# EAGLE board registers2-4a (EAGLE 7.5.0), part 1 of 3
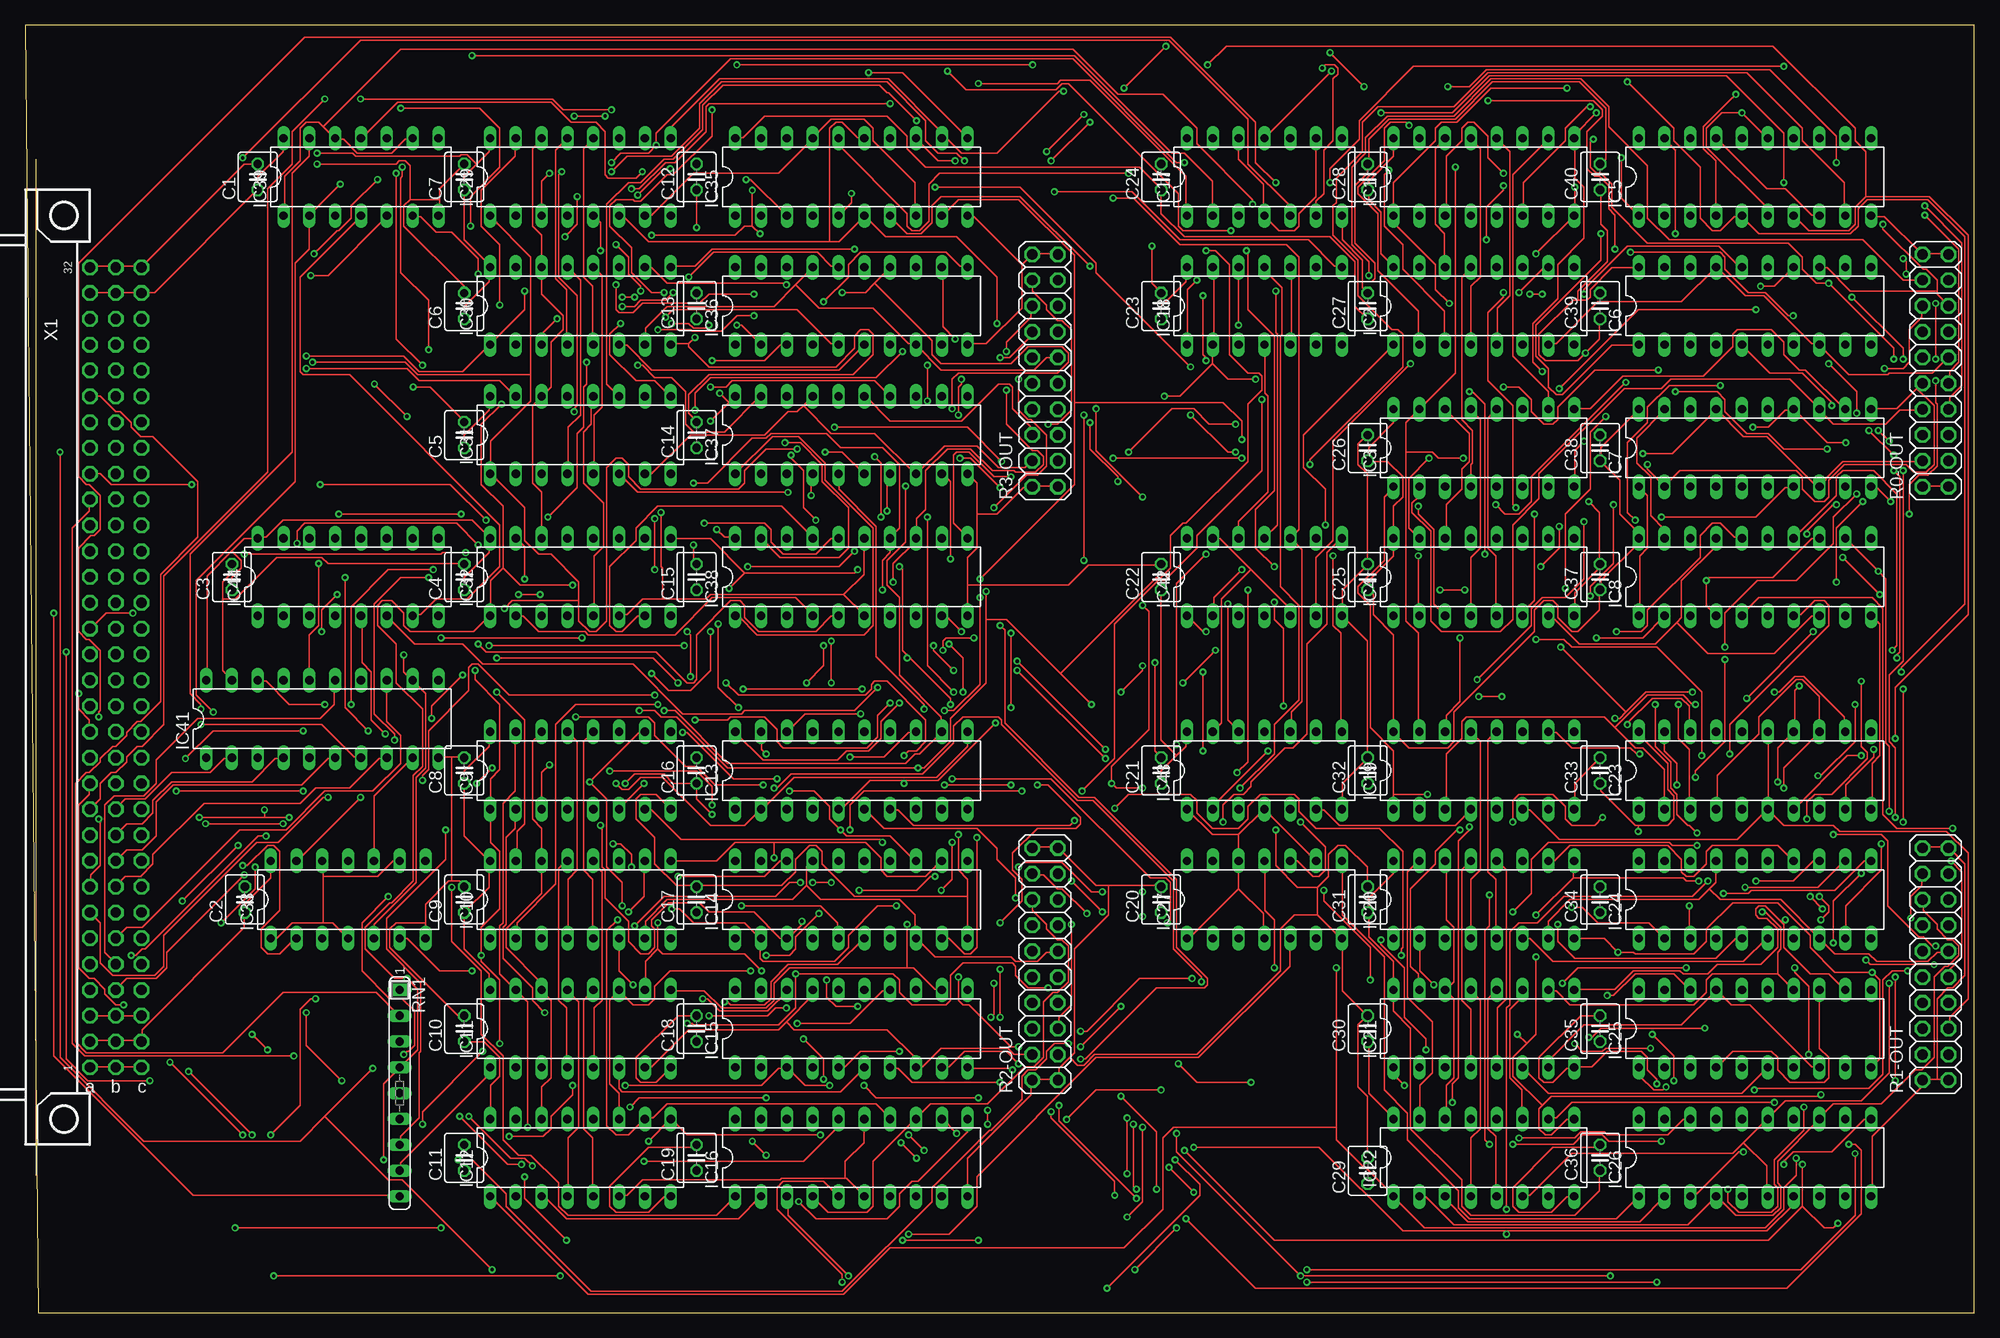
[diagram p3: board, top side]
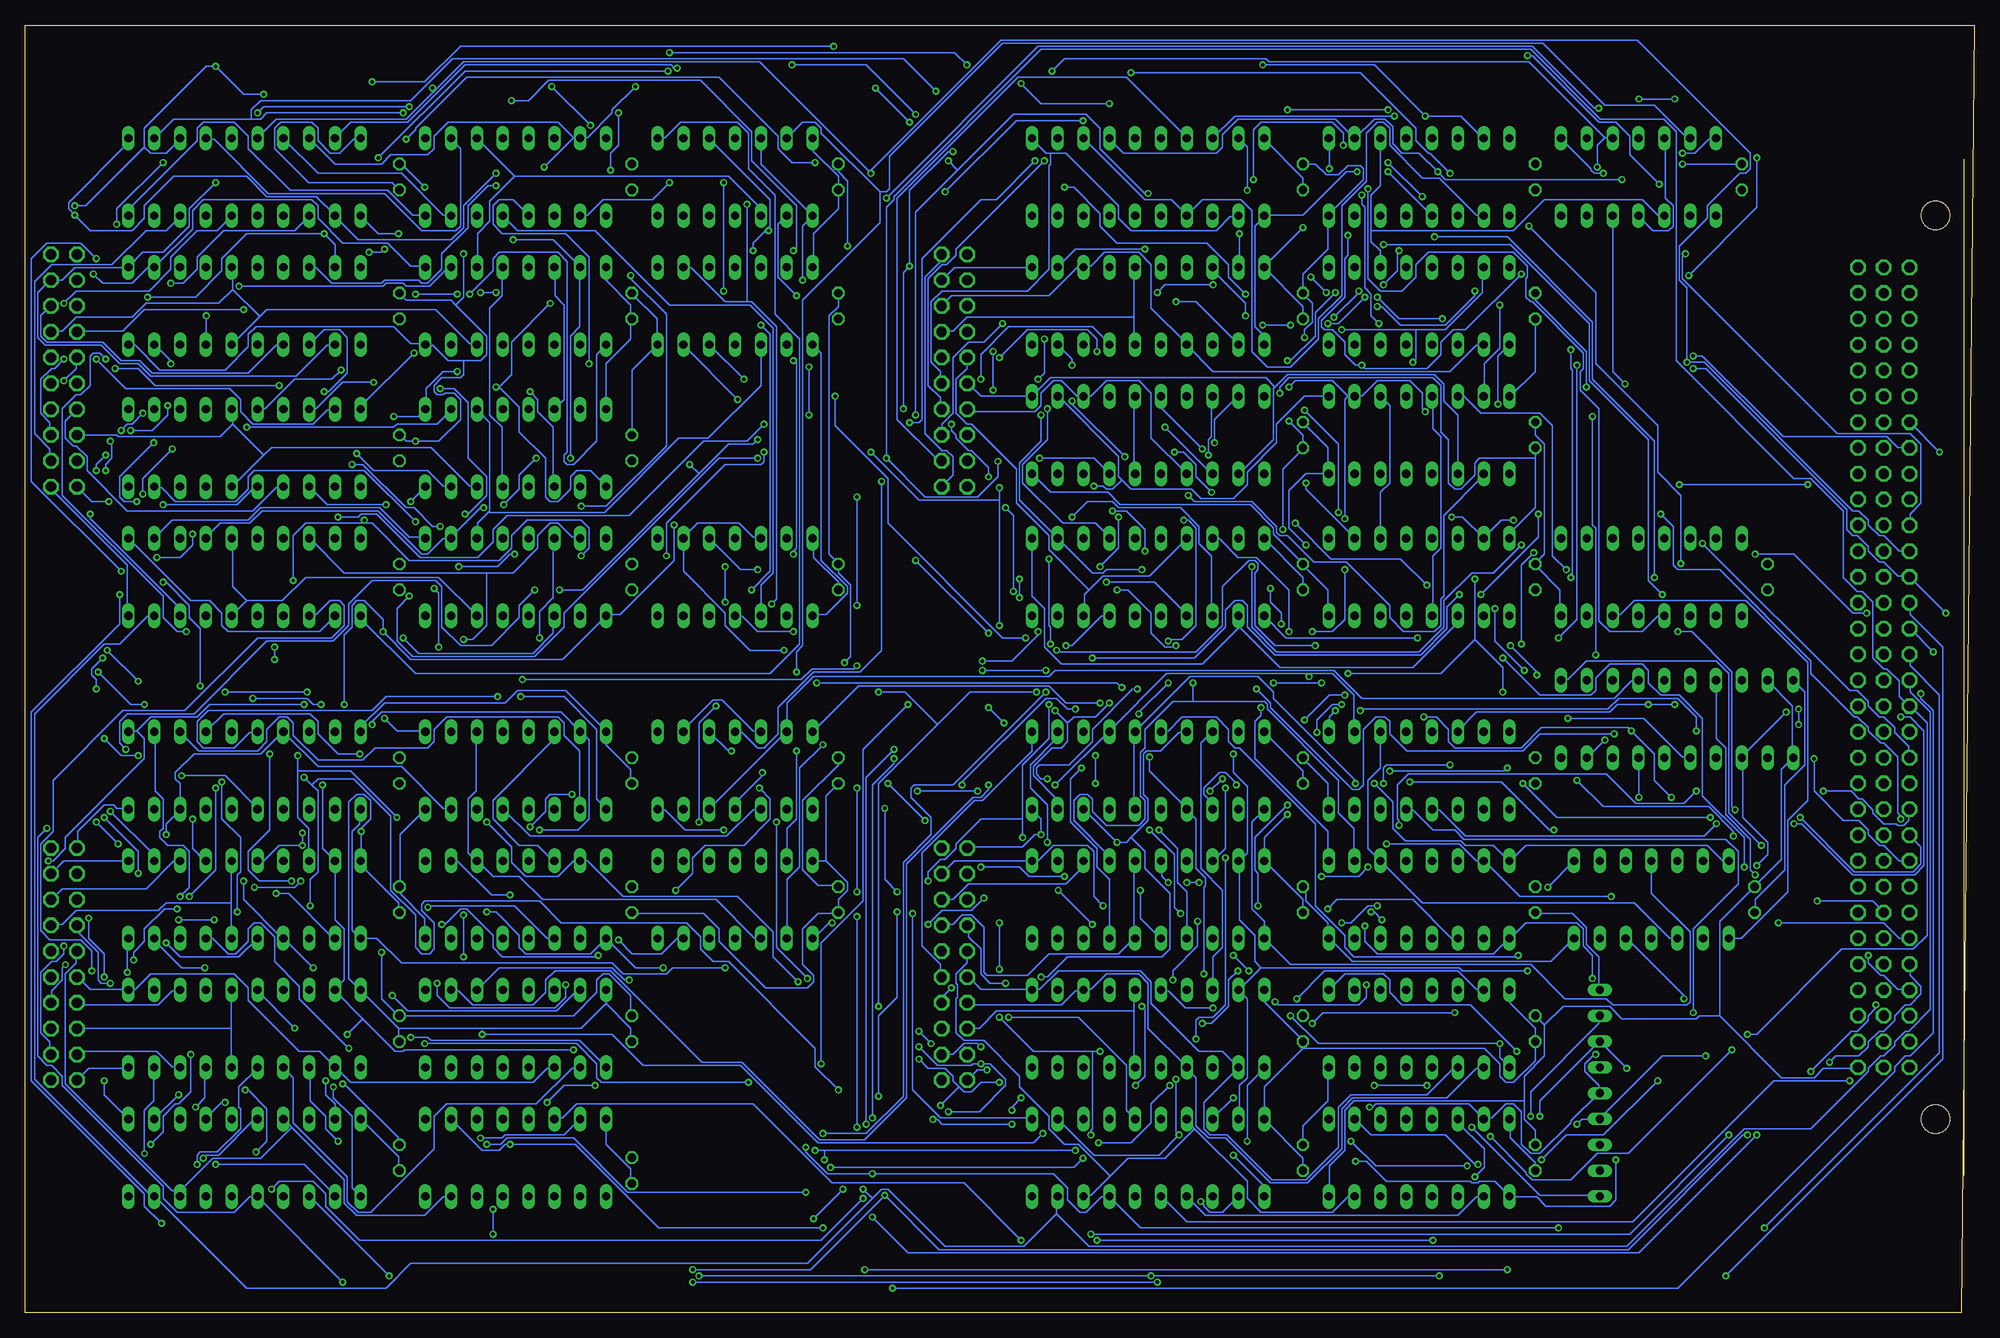
[diagram p4: board, bottom side, seen from below]

Size 191.75 x 126.67 mm. Coordinates in mm from the lower left corner, seen from the top.
Outline: 1.27,0 191.75,0 191.75,126.67 0,126.67 1.27,0
Copper layers (1*16): Top 0.0356mm / dielectric 1.5011mm / Bottom 0.0356mm
Design rules "LaenPCBOrder *": minimum track width 6mil, minimum drill 13mil, track to track 6mil, track to pad 6mil, pad to pad 6mil, via to via 6mil, smd to smd 6mil, copper to edge 15mil, drill to drill 6mil, minimum pad ring 7mil, minimum via ring 7mil, stop-mask expansion 3mil, vias tented up to drill 0mil, thermal gap 10mil

## Footprints (pad centres in the part's own frame; a part is rotated, then mirrored left to right if it is on the bottom)
C025-040X050 = drill 0.813 octagon: 1 -1.27,0; 2 1.27,0
DIL16 = drill 0.813 long: 1 -8.89,-3.81; 2 -6.35,-3.81; 3 -3.81,-3.81; 4 -1.27,-3.81; 5 1.27,-3.81; 6 3.81,-3.81; 7 6.35,-3.81; 8 8.89,-3.81; 9 8.89,3.81; 10 6.35,3.81; 11 3.81,3.81; 12 1.27,3.81; 13 -1.27,3.81; 14 -3.81,3.81; 15 -6.35,3.81; 16 -8.89,3.81
DIL20 = drill 0.813 long: 1 -11.43,-3.81; 2 -8.89,-3.81; 3 -6.35,-3.81; 4 -3.81,-3.81; 5 -1.27,-3.81; 6 1.27,-3.81; 7 3.81,-3.81; 8 6.35,-3.81; 9 8.89,-3.81; 10 11.43,-3.81; 11 11.43,3.81; 12 8.89,3.81; 13 6.35,3.81; 14 3.81,3.81; 15 1.27,3.81; 16 -1.27,3.81; 17 -3.81,3.81; 18 -6.35,3.81; 19 -8.89,3.81; 20 -11.43,3.81
DIL14 = drill 0.813 long: 1 -7.62,-3.81; 2 -5.08,-3.81; 3 -2.54,-3.81; 4 0,-3.81; 5 2.54,-3.81; 6 5.08,-3.81; 7 7.62,-3.81; 8 7.62,3.81; 9 5.08,3.81; 10 2.54,3.81; 11 0,3.81; 12 -2.54,3.81; 13 -5.08,3.81; 14 -7.62,3.81
2X10 = drill 1.016 octagon: 1 -11.43,-1.27; 2 -11.43,1.27; 3 -8.89,-1.27; 4 -8.89,1.27; 5 -6.35,-1.27; 6 -6.35,1.27; 7 -3.81,-1.27; 8 -3.81,1.27; 9 -1.27,-1.27; 10 -1.27,1.27; 11 1.27,-1.27; 12 1.27,1.27; 13 3.81,-1.27; 14 3.81,1.27; 15 6.35,-1.27; 16 6.35,1.27; 17 8.89,-1.27; 18 8.89,1.27; 19 11.43,-1.27; 20 11.43,1.27
SIL9 = drill 0.813 long: 1 -10.16,0; 2 -7.62,0; 3 -5.08,0; 4 -2.54,0; 5 0,0; 6 2.54,0; 7 5.08,0; 8 7.62,0; 9 10.16,0
FABC96R = drill 1.016 octagon: A1 -2.54,39.37; A2 -2.54,36.83; A3 -2.54,34.29; A4 -2.54,31.75; A5 -2.54,29.21; A6 -2.54,26.67; A7 -2.54,24.13; A8 -2.54,21.59; A9 -2.54,19.05; A10 -2.54,16.51; A11 -2.54,13.97; A12 -2.54,11.43; A13 -2.54,8.89; A14 -2.54,6.35; A15 -2.54,3.81; A16 -2.54,1.27; A17 -2.54,-1.27; A18 -2.54,-3.81; A19 -2.54,-6.35; A20 -2.54,-8.89; A21 -2.54,-11.43; A22 -2.54,-13.97; A23 -2.54,-16.51; A24 -2.54,-19.05; A25 -2.54,-21.59; A26 -2.54,-24.13; A27 -2.54,-26.67; A28 -2.54,-29.21; A29 -2.54,-31.75; A30 -2.54,-34.29; A31 -2.54,-36.83; A32 -2.54,-39.37; B1 -5.08,39.37; B2 -5.08,36.83; B3 -5.08,34.29; B4 -5.08,31.75; B5 -5.08,29.21; B6 -5.08,26.67; B7 -5.08,24.13; B8 -5.08,21.59; B9 -5.08,19.05; B10 -5.08,16.51; B11 -5.08,13.97; B12 -5.08,11.43; B13 -5.08,8.89; B14 -5.08,6.35; B15 -5.08,3.81; B16 -5.08,1.27; B17 -5.08,-1.27; B18 -5.08,-3.81; B19 -5.08,-6.35; B20 -5.08,-8.89; B21 -5.08,-11.43; B22 -5.08,-13.97; B23 -5.08,-16.51; B24 -5.08,-19.05; B25 -5.08,-21.59; B26 -5.08,-24.13; B27 -5.08,-26.67; B28 -5.08,-29.21; B29 -5.08,-31.75; B30 -5.08,-34.29; B31 -5.08,-36.83; B32 -5.08,-39.37; C1 -7.62,39.37; C2 -7.62,36.83; C3 -7.62,34.29; C4 -7.62,31.75; C5 -7.62,29.21; C6 -7.62,26.67; C7 -7.62,24.13; C8 -7.62,21.59; C9 -7.62,19.05; C10 -7.62,16.51; C11 -7.62,13.97; C12 -7.62,11.43; C13 -7.62,8.89; C14 -7.62,6.35; C15 -7.62,3.81; C16 -7.62,1.27; C17 -7.62,-1.27; C18 -7.62,-3.81; C19 -7.62,-6.35; C20 -7.62,-8.89; C21 -7.62,-11.43; C22 -7.62,-13.97; C23 -7.62,-16.51; C24 -7.62,-19.05; C25 -7.62,-21.59; C26 -7.62,-24.13; C27 -7.62,-26.67; C28 -7.62,-29.21; C29 -7.62,-31.75; C30 -7.62,-34.29; C31 -7.62,-36.83; C32 -7.62,-39.37 | hole 2.794: 0,-44.456; 0,44.456

## Placement (x,y rotation side)
C1  [C025-040X050]  22.86,111.76 90 top
C2  [C025-040X050]  21.59,40.64 90 top
C3  [C025-040X050]  20.32,72.39 90 top
C4  [C025-040X050]  43.18,72.39 90 top
C5  [C025-040X050]  43.18,86.36 90 top
C6  [C025-040X050]  43.18,99.06 90 top
C7  [C025-040X050]  43.18,111.76 90 top
C8  [C025-040X050]  43.18,53.34 90 top
C9  [C025-040X050]  43.18,40.64 90 top
C10  [C025-040X050]  43.18,27.94 90 top
C11  [C025-040X050]  43.18,15.24 90 top
C12  [C025-040X050]  66.04,111.76 90 top
C13  [C025-040X050]  66.04,99.06 90 top
C14  [C025-040X050]  66.04,86.36 90 top
C15  [C025-040X050]  66.04,72.39 90 top
C16  [C025-040X050]  66.04,53.34 90 top
C17  [C025-040X050]  66.04,40.64 90 top
C18  [C025-040X050]  66.04,27.94 90 top
C19  [C025-040X050]  66.04,15.24 90 top
C20  [C025-040X050]  111.76,40.64 90 top
C21  [C025-040X050]  111.76,53.34 90 top
C22  [C025-040X050]  111.76,72.39 90 top
C23  [C025-040X050]  111.76,99.06 90 top
C24  [C025-040X050]  111.76,111.76 90 top
C25  [C025-040X050]  132.08,72.39 90 top
C26  [C025-040X050]  132.08,85.09 90 top
C27  [C025-040X050]  132.08,99.06 90 top
C28  [C025-040X050]  132.08,111.76 90 top
C29  [C025-040X050]  132.08,13.97 90 top
C30  [C025-040X050]  132.08,27.94 90 top
C31  [C025-040X050]  132.08,40.64 90 top
C32  [C025-040X050]  132.08,53.34 90 top
C33  [C025-040X050]  154.94,53.34 90 top
C34  [C025-040X050]  154.94,40.64 90 top
C35  [C025-040X050]  154.94,27.94 90 top
C36  [C025-040X050]  154.94,15.24 90 top
C37  [C025-040X050]  154.94,72.39 90 top
C38  [C025-040X050]  154.94,85.09 90 top
C39  [C025-040X050]  154.94,99.06 90 top
C40  [C025-040X050]  154.94,111.76 90 top
IC1  74LS192N  [DIL16]  143.51,111.76 0 top
IC2  74LS192N  [DIL16]  143.51,99.06 0 top
IC3  74LS192N  [DIL16]  143.51,85.09 0 top
IC4  74LS192N  [DIL16]  143.51,72.39 0 top
IC5  74LS244N  [DIL20]  170.18,111.76 0 top
IC6  74LS244N  [DIL20]  170.18,99.06 0 top
IC7  74LS244N  [DIL20]  170.18,85.09 0 top
IC8  74LS244N  [DIL20]  170.18,72.39 0 top
IC9  74LS192N  [DIL16]  54.61,53.34 0 top
IC10  74LS192N  [DIL16]  54.61,40.64 0 top
IC11  74LS192N  [DIL16]  54.61,27.94 0 top
IC12  74LS192N  [DIL16]  54.61,15.24 0 top
IC13  74LS244N  [DIL20]  81.28,53.34 0 top
IC14  74LS244N  [DIL20]  81.28,40.64 0 top
IC15  74LS244N  [DIL20]  81.28,27.94 0 top
IC16  74LS244N  [DIL20]  81.28,15.24 0 top
IC17  7400N  [DIL14]  121.92,111.76 0 top
IC18  7400N  [DIL14]  121.92,99.06 0 top
IC19  74LS192N  [DIL16]  143.51,53.34 0 top
IC20  74LS192N  [DIL16]  143.51,40.64 0 top
IC21  74LS192N  [DIL16]  143.51,27.94 0 top
IC22  74LS192N  [DIL16]  143.51,15.24 0 top
IC23  74LS244N  [DIL20]  170.18,53.34 0 top
IC24  74LS244N  [DIL20]  170.18,40.64 0 top
IC25  74LS244N  [DIL20]  170.18,27.94 0 top
IC26  74LS244N  [DIL20]  170.18,15.24 0 top
IC27  7400N  [DIL14]  121.92,40.64 0 top
IC29  74LS192N  [DIL16]  54.61,111.76 0 top
IC30  74LS192N  [DIL16]  54.61,99.06 0 top
IC31  74LS192N  [DIL16]  54.61,86.36 0 top
IC32  74LS192N  [DIL16]  54.61,72.39 0 top
IC33  7400N  [DIL14]  31.75,40.64 0 top
IC35  74LS244N  [DIL20]  81.28,111.76 0 top
IC36  74LS244N  [DIL20]  81.28,99.06 0 top
IC37  74LS244N  [DIL20]  81.28,86.36 0 top
IC38  74LS244N  [DIL20]  81.28,72.39 0 top
IC39  7400N  [DIL14]  33.02,111.76 0 top
IC41  74S244N  [DIL20]  29.21,58.42 0 top
IC42  74LS08N  [DIL14]  121.92,72.39 0 top
IC43  74LS08N  [DIL14]  121.92,53.34 0 top
IC44  74LS139N  [DIL16]  31.75,72.39 0 top
R0-OUT  [2X10]  187.96,92.71 90 top
R1-OUT  [2X10]  187.96,34.29 90 top
R2-OUT  [2X10]  100.33,34.29 90 top
R3-OUT  [2X10]  100.33,92.71 90 top
RN1  [SIL9]  36.83,21.59 270 top
X1  FABC96R  [FABC96R]  3.81,63.5 180 top

## Tracks (layer width: path | path; a pad name or v marks a point on that pad's centre or on a via)
+12V
  Top 0.152: X1.A3 X1.B3 X1.C3
ADDR0  (via drill 0.33)
  Top 0.152: v90.42,59.23 91.34,59.23 93.93,61.82 v93.93,70.36 | v93.93,72.19 103.23,81.48 103.23,89.56 | 103.23,89.56 103.23,104.04 97.74,109.52 91.8,109.52 90.27,108 IC35.9 | v181.86,55.42 181.86,54.66 179.12,51.92 179.12,49.63 IC23.9 | v139.19,71.12 v141.63,71.12 | v119.69,85.9 119.69,87.73 117.86,89.56 103.23,89.56 | v126.39,83.46 126.39,83.92 135.53,93.07 135.53,96.27 135.08,96.72 134.47,96.72 131.12,100.08 131.12,103.58 128.68,106.02 128.68,108.91 128.98,109.22 128.98,111.66 131.57,114.25 131.57,117.14 133.1,118.67 140.56,118.67 143.92,122.02 169.37,122.02 174.85,116.53 174.85,115.32 178.97,111.2 178.97,108 IC5.9 | v10.41,35.15 10.87,35.15 11.48,35.76 11.79,35.76 22.91,46.89 v23.67,46.89 | v39.07,52.38 39.07,52.83 39.68,53.44 39.68,57.25 43.64,61.21 43.64,63.5 43.94,63.8 44.55,63.8 47.6,60.76 v61.93,60.76 | v65.89,58.32 69.09,58.32 69.39,58.62 72.75,58.62 73.96,57.4 73.96,56.19 74.57,55.58 82.8,55.58 83.87,56.64 83.87,58.78 v85.09,60
  Bottom 0.152: 89.2,58.01 89.2,56.19 89.81,55.58 90.73,55.58 92.56,53.75 92.56,52.83 90.27,50.55 90.27,49.63 IC13.9 | v90.42,59.23 89.2,58.01 | v93.93,72.19 v93.93,70.36 | v181.86,55.42 182.47,56.03 182.47,58.17 181.71,58.93 175.16,58.93 168,66.09 161.44,66.09 159.92,67.61 159.92,69.75 157.63,72.03 151.38,72.03 150.77,71.42 150.77,67.46 148.95,65.63 145.9,65.63 143.15,68.38 143.15,69.6 v141.63,71.12 | v139.19,71.12 136.91,71.12 125.48,82.55 | 125.48,82.55 122.58,85.45 120.14,85.45 v119.69,85.9 | 125.48,82.55 v126.39,83.46 | v10.41,35.15 10.41,34.39 9.2,33.17 8.89,33.17 7.52,31.8 6.45,31.8 X1.A4 | v23.67,46.89 23.67,47.35 26.11,49.78 36.47,49.78 v39.07,52.38 | v61.93,60.76 63.45,60.76 v65.89,58.32 | v85.09,60 86.46,58.62 88.59,58.62 89.2,58.01
ADDR1  (via drill 0.33)
  Top 0.152: IC23.7 179.27,54.81 v180.65,54.81 | v184,56.49 184,61.52 191.16,68.68 191.16,106.02 187.35,109.83 181.1,109.83 | 181.1,109.83 180.03,108.76 180.03,107.09 179.43,106.48 175.46,106.48 IC5.7 | v103.23,48.41 102.77,47.95 87.38,47.95 85.85,49.48 85.09,49.48 IC13.7 | v109.93,69.6 110.54,68.99 110.54,57.4 106.88,53.75 v106.88,52.07 107.34,51.61 v109.93,51.61 | v109.93,80.26 105.36,84.84 v105.36,88.95 | v104.75,102.97 97.89,109.83 90.12,109.83 89.2,108.91 89.2,107.24 88.14,106.17 86.77,106.17 85.09,107.85 IC35.7 | v21.39,17.48 v14.22,24.64 | v108.41,9.4 109.93,10.92 v109.93,18.24 | v109.93,41.4 v109.93,38.96 | 181.1,109.83 181.1,114.25 180.03,115.32 180.03,116.53 171.96,124.61 118.16,124.61 v116.33,122.78 | v100.48,114.25 v104.14,117.91
  Bottom 0.152: v180.65,54.81 182.32,54.81 v184,56.49 | v106.88,52.07 v103.23,48.41 | v109.93,80.26 v109.93,69.6 | v105.36,88.95 105.36,102.36 v104.75,102.97 104.75,110.44 100.94,114.25 v100.48,114.25 | v14.22,24.64 13.61,25.25 11.33,25.25 10.41,26.16 10.41,26.62 9.35,27.69 8.89,27.69 7.82,28.75 7.82,29.21 6.76,30.28 6.3,30.28 5.23,31.34 5.23,32.11 6.3,33.17 6.3,34.24 X1.A5 | v21.39,17.48 32.97,5.89 104.9,5.89 v108.41,9.4 | v109.93,38.96 v109.93,18.24 | v109.93,51.61 v109.93,41.4 | v116.33,122.78 109.02,122.78 v104.14,117.91
ADDR2  (via drill 0.33)
  Top 0.152: v176.38,52.83 176.68,52.83 180.03,56.19 v180.03,59.84 | v184.61,63.04 184.61,63.5 190.86,69.75 190.86,105.87 187.2,109.52 181.25,109.52 180.34,108.61 180.34,106.93 179.58,106.17 170.59,106.17 168.91,107.85 | 86.46,52.38 89.81,52.38 v95.45,58.01 | 86.46,52.38 83.11,52.38 80.37,49.63 80.06,49.63 IC13.5 | v96.98,66.85 v96.98,59.54 | v104.14,88.34 v104.14,74.02 | v81.28,110.13 81.28,109.22 IC35.5 | v19.25,38.35 22.61,41.71 v22.61,43.84 | v46.38,64.41 61.77,64.41 v64.21,61.98 | v68.94,61.98 70.16,60.76 82.65,60.76 83.26,61.37 83.26,61.82 83.57,62.13 84.78,62.13 88.59,58.32 88.59,56.19 87.68,55.27 86.92,55.27 v86.46,54.81 | 86.46,52.38 v86.46,52.07 | 168.91,107.85 168.15,107.85 166.78,106.48 166.01,106.48 164.8,107.7 164.8,112.72 162.2,115.32 162.2,116.53 v157.63,121.11 | v108.1,120.5 v112.22,124.61 | v100.94,113.33 v104.75,117.14 | 168.91,107.85 IC5.5
  Bottom 0.152: v176.38,52.83 172.11,52.83 168.91,49.63 IC23.5 | v180.03,59.84 181.41,59.84 v184.61,63.04 | v96.98,59.54 v95.45,58.01 | v104.14,74.02 v96.98,66.85 | v104.14,88.34 104.14,108.31 100.02,112.42 | 100.02,112.42 94.54,117.91 87.38,117.91 86,116.53 86,114.55 81.58,110.13 v81.28,110.13 | X1.A6 7.37,36.83 8.89,38.35 v19.25,38.35 | v22.61,43.84 22.61,46.74 26.72,50.85 26.72,58.47 29.01,60.76 30.84,60.76 32.05,61.98 32.05,63.2 32.66,63.8 35.87,63.8 37.24,62.43 37.24,61.21 37.69,60.76 42.72,60.76 v46.38,64.41 | v68.94,61.98 v64.21,61.98 | v86.46,52.07 v86.46,54.81 | v157.63,121.11 152.45,121.11 148.95,124.61 v112.22,124.61 | v104.75,117.14 v108.1,120.5 | 100.02,112.42 v100.94,113.33
ADDR3  (via drill 0.33)
  Top 0.152: v162.66,59.84 162.66,56.49 163.73,55.42 163.73,49.63 IC23.3 | v175.92,67 v169.37,60.45 | v183.84,93.83 183.84,94.89 v177.44,101.29 176.23,101.29 174.85,102.67 174.85,103.89 173.48,105.26 159.61,105.26 156.11,108.76 156.11,111.05 155.04,112.12 154.58,112.12 153.98,112.72 153.98,115.16 v154.28,115.47 | v72.59,51.92 67.87,51.92 66.04,53.75 64.97,53.75 61.93,56.79 61.93,58.01 61.32,58.62 v54.15,58.62 | v29.77,50.7 29.31,50.7 24.89,46.28 22.76,46.28 13.61,37.13 13.61,34.09 12.7,33.17 8.59,33.17 7.37,34.39 7.37,38.35 X1.A7 | IC35.3 71.37,111.51 v70.92,111.51 | v57.66,113.18 58.57,114.1 61.32,114.1 v62.08,114.86 62.08,116.08 69.39,123.39 103.07,123.39 113.28,113.18 v114.05,113.18 | v54.3,109.83 54.3,107.09 v53.09,105.87 | v31.45,72.34 31.45,59.54 v33.73,57.25
  Bottom 0.152: v162.66,59.84 163.42,59.84 164.03,60.45 v169.37,60.45 | v175.92,67 176.84,67 178.21,68.38 178.21,70.51 188.11,80.42 188.11,88.95 186.74,90.32 186.28,90.32 185.37,91.24 185.37,94.13 185.06,94.44 184.46,94.44 v183.84,93.83 | v177.44,101.29 176.23,101.29 174.85,102.67 174.85,103.89 172.26,106.48 165.25,106.48 163.88,107.85 IC5.3 | v72.59,51.92 72.59,52.07 73.66,53.14 74.27,53.14 75.79,51.61 75.79,51 75.03,50.24 75.03,49.63 IC13.3 | v54.15,58.62 52.93,58.62 51.71,57.4 51.71,56.19 51.11,55.58 44.55,55.58 42.57,57.56 34.04,57.56 v33.73,57.25 31.45,54.97 31.45,52.38 v29.77,50.7 | v70.92,111.51 70.92,116.38 70.16,117.14 63.14,117.14 62.08,116.08 v62.08,114.86 | v54.3,109.83 v57.66,113.18 | v53.09,105.87 45.92,105.87 37.54,97.48 37.54,91.85 31.45,85.75 v31.45,72.34 | v154.28,115.47 153.37,116.38 153.37,116.53 148.34,121.56 123.49,121.56 117.7,115.77 117.7,114.55 116.33,113.18 v114.05,113.18
ADDR4  (via drill 0.33)
  Top 0.152: v182.63,46.13 182.63,43.54 179.12,40.03 179.12,36.83 IC24.9 | v184.76,61.37 v184.76,48.26 | v184.15,64.41 184.15,64.72 184.46,65.02 184.46,82.24 v183.84,82.85 | v182.32,86.82 v183.39,85.75 | v180.19,88.49 180.19,90.63 v177.44,93.37 | IC14.9 90.88,36.83 92.41,35.31 93.02,35.31 93.62,35.92 v93.62,46.74 | v91.03,59.84 91.03,60.45 86.92,64.57 | 86.92,64.57 86.31,65.18 86.31,73.1 v86,73.41 | v84.18,78.28 84.18,83.62 v83.57,84.23 | v88.75,93.22 v88.75,89.71 | v7.21,48.57 7.37,48.41 7.37,43.99 6.45,43.08 6.45,42.01 X1.A8 | v42.88,78.59 v30.84,78.59 | v50.65,70.66 v48.51,70.66 | 86.92,64.57 v86.77,64.41 | v174.09,33.93 174.09,33.48 175.46,32.11 v175.46,25.4 | v179.43,16.56 180.03,16.56 180.65,15.95 180.65,9.7 173.33,2.39 121.06,2.39 v114.2,9.25 | v111.3,12.14 111.3,17.78 v107.8,21.29 | v102.92,42.47 v105.97,39.42
  Bottom 0.152: v184.76,48.26 v182.63,46.13 | v184.76,61.37 184.76,62.28 185.22,62.74 185.22,63.35 v184.15,64.41 | v183.84,82.85 183.84,83.46 183.24,84.07 183.24,85.6 v183.39,85.75 | v182.32,86.82 181.71,87.43 181.25,87.43 v180.19,88.49 | v177.44,93.37 177.44,93.67 178.97,95.2 IC6.9 | 93.62,48.57 93.62,53.9 91.03,56.49 v91.03,59.84 | 93.62,48.57 v93.62,46.74 | v86,73.41 84.18,75.23 v84.18,78.28 | v83.57,84.23 88.75,89.41 v88.75,89.71 | v88.75,93.22 88.75,93.83 IC36.9 | v7.21,48.57 7.21,48.87 7.52,49.17 7.52,54.66 8.89,56.03 9.2,56.03 10.41,57.25 10.41,57.56 11.48,58.62 11.79,58.62 16.05,62.89 16.05,64.11 25.04,73.1 29.16,73.1 29.62,73.56 29.62,77.37 v30.84,78.59 | v42.88,78.59 42.88,76.3 v48.51,70.66 | v50.65,70.66 51.87,69.44 51.87,67.31 54.46,64.72 68.78,64.72 71.53,67.46 71.53,69.6 71.98,70.05 72.75,70.05 73.66,69.14 73.66,67.46 76.71,64.41 v86.77,64.41 | v174.09,33.93 176.38,33.93 178.97,36.52 178.97,36.83 IC24.9 | v175.46,25.4 175.46,21.74 176.68,20.52 176.99,20.52 178.21,19.3 178.21,17.78 v179.43,16.56 | v111.3,12.14 v114.2,9.25 | v107.8,21.29 107.8,29.21 105.97,31.04 v105.97,39.42 | v102.92,42.47 102.92,43.38 101.7,44.6 101.24,44.6 100.18,45.67 100.18,46.13 97.74,48.57 93.62,48.57
ADDR5  (via drill 0.33)
  Top 0.152: v94.54,70.97 94.54,68.22 | 94.54,68.22 94.54,61.98 91.03,58.47 91.03,56.19 88.44,53.59 v87.83,53.59 69.09,53.59 64.06,58.62 62.54,58.62 61.93,59.23 v60.4,59.23 | v95.3,79.2 98.5,82.4 99.57,82.4 100.48,83.31 100.48,86.36 98.96,87.88 98.65,87.88 97.74,88.8 v97.74,91.85 | v159.92,26.01 155.5,26.01 155.19,25.7 153.21,25.7 v152.45,26.47 | v120.6,22.66 115.27,22.66 v113.44,24.49 | 101.85,62.89 96.52,68.22 94.54,68.22 | 101.85,62.89 v104.9,59.84 | v173.94,98.09 173.48,98.09 171.2,100.38 169.52,100.38 167.23,102.67 167.23,103.89 166.78,104.34 v157.94,104.34 | v156.41,104.65 156.41,108 155.8,108.61 155.8,110.9 154.89,111.81 154.43,111.81 153.67,112.57 153.67,116.23 155.19,117.75 155.19,118.36 154.28,119.28 v143.92,119.28 | v116.18,104.5 117.09,104.5 118.47,103.12 118.47,94.28 120.29,92.46 121.36,92.46 121.67,92.15 121.67,90.78 120.29,89.41 120.29,83.77 114.2,77.67 113.89,77.67 112.67,76.45 112.67,73.25 111.76,72.34 111.3,72.34 101.85,62.89 | v15.75,54.51 18.49,57.25 v27.33,57.25
  Bottom 0.152: IC14.7 85.09,42.62 86.31,43.84 86.31,45.67 88.9,48.26 88.9,52.53 v87.83,53.59 | v94.54,70.97 94.54,78.43 v95.3,79.2 | v97.74,91.85 97.74,94.28 95,97.03 86.77,97.03 85.09,95.35 IC36.7 | IC24.7 173.33,36.83 171.81,35.31 171.04,35.31 169.82,36.52 169.82,37.74 169.22,38.35 168.61,38.35 167.23,36.98 167.23,34.54 164.8,32.11 164.8,30.89 v159.92,26.01 | v152.45,26.47 137.52,26.47 135.53,24.49 135.53,23.11 135.08,22.66 v120.6,22.66 | v113.44,24.49 113.44,36.37 109.32,40.49 109.32,55.42 v104.9,59.84 | v173.94,98.09 173.94,95.35 IC6.7 | v157.94,104.34 156.72,104.34 v156.41,104.65 | v143.92,119.28 142.24,119.28 140.26,121.26 125.32,121.26 120.29,116.23 120.29,113.33 115.88,108.91 115.88,104.8 v116.18,104.5 | X1.A9 7.37,44.45 8.89,45.97 9.35,45.97 10.41,47.04 10.41,47.5 11.33,48.41 12.85,48.41 15.75,51.31 v15.75,54.51 | v27.33,57.25 27.33,58.62 29.16,60.45 34.95,60.45 36.02,59.38 60.25,59.38 v60.4,59.23
ADDR6  (via drill 0.33)
  Top 0.152: v177.9,36.37 177.9,40.49 v180.65,43.23 | v184,48.72 184,55.58 183.39,56.19 183.39,62.74 184.76,64.11 v184.76,82.85 | v181.41,86.82 v183.84,84.38 | v177.75,89.26 177.75,89.56 174.85,92.46 171.65,92.46 168.91,95.2 IC6.5 | v70.46,40.03 78.23,40.03 79.91,38.35 79.91,36.83 IC14.5 | v67.56,49.94 67.56,51.77 66.04,53.29 v57.51,53.29 | v44.4,52.07 v45.92,53.59 | v17.12,48.72 23.52,48.72 | 23.52,48.72 v25.96,48.72 | v62.99,97.94 63.75,98.7 75.95,98.7 79.3,95.35 79.91,95.35 IC36.5 | v60.55,100.53 60.55,100.99 59.33,102.21 59.33,103.89 v58.12,105.1 | v30.68,70.66 29.16,69.14 v29.16,67 | 23.52,48.72 v23.52,49.48 | IC24.5 168.3,36.83 166.32,34.85 152.45,34.85 150.77,36.52 v150.77,38.2 | v135.38,35.15 135.38,35.76 135.53,35.92 135.53,45.36 133.25,47.65 127,47.65 125.32,49.33 125.32,50.55 124.87,51 121.51,51 120.29,49.78 120.29,48.57 119.38,47.65 116.79,47.65 115.27,49.17 115.27,50.39 114.66,51 108.56,51 v107.19,49.63 | v105.97,41.4 104.9,41.4 102.01,44.3 98.2,44.3 v97.74,43.84 | v89.51,42.93 89.05,42.93 87.68,41.55 v82.04,41.55
  Bottom 0.152: IC24.5 170.74,35 176.53,35 v177.9,36.37 | v180.65,43.23 180.65,45.36 v184,48.72 | v184.76,82.85 184.76,83.46 v183.84,84.38 | v181.41,86.82 179.27,86.82 177.75,88.34 v177.75,89.26 | v70.46,40.03 70.46,43.23 70.76,43.54 70.76,46.74 v67.56,49.94 | v57.51,53.29 46.23,53.29 v45.92,53.59 | v44.4,52.07 41.05,48.72 v25.96,48.72 | v17.12,48.72 11.79,43.38 5.99,43.38 5.23,44.15 5.23,45.82 6.3,46.89 X1.A10 | v62.99,97.94 60.55,100.38 v60.55,100.53 | v58.12,105.1 45.62,105.1 37.85,97.33 37.85,91.69 32.05,85.9 32.05,72.03 v30.68,70.66 | v29.16,67 27.79,67 23.82,63.04 23.82,49.78 v23.52,49.48 | v150.77,38.2 150.47,38.2 148.95,39.73 148.34,39.73 145.75,37.13 145.75,35.92 144.83,35 135.53,35 v135.38,35.15 | v107.19,49.63 107.19,42.62 v105.97,41.4 | v97.74,43.84 93.93,43.84 93.02,42.93 v89.51,42.93 | v82.04,41.55 82.04,38.81 80.06,36.83 IC14.5
ADDR7  (via drill 0.33)
  Top 0.152: v163.73,40.03 163.73,36.83 IC24.3 | v164.34,52.68 164.34,53.29 167.23,56.19 v167.23,64.26 | v167.23,65.48 167.23,68.83 170.43,72.03 174.24,72.03 177.9,75.69 177.9,78.28 v180.19,80.57 | v177.29,84.99 173.03,84.99 171.5,86.51 169.37,86.51 167.23,88.65 167.23,89.86 166.47,90.63 v162.36,90.63 | v56.59,47.95 56.74,47.8 56.74,43.84 57.05,43.54 57.05,40.79 59.33,38.51 59.33,36.52 60.55,35.31 61.32,35.31 61.93,35.92 61.93,37.74 61.62,38.05 61.62,38.66 63.3,40.34 66.34,40.34 67.26,39.42 71.68,39.42 74.27,36.83 IC14.3 75.03,36.83 76.4,38.2 v76.4,38.51 | v14.83,51.31 v27.33,51.31 | v67.56,93.67 72.75,93.67 74.27,95.2 74.88,95.2 IC36.3 | v62.84,100.38 61.62,100.38 59.64,102.36 59.64,104.8 57.51,106.93 57.51,108.91 58.12,109.52 59.79,109.52 59.94,109.37 60.55,109.37 63.14,111.96 63.75,111.96 67.56,115.77 v67.56,118.36 | v57.66,118.36 52.93,118.36 51.87,119.43 v32.97,119.43 | v29.46,119.43 26.26,116.23 26.26,113.03 23.82,110.59 23.82,82.7 13.61,72.49 13.61,57.86 11.48,55.73 11.02,55.73 9.96,54.66 9.96,54.2 8.89,53.14 8.43,53.14 7.37,52.07 7.37,50.55 X1.A11 | v111.76,21.89 105.36,21.89 v102.46,19 | v94.69,19.91 v94.69,18.54 | v93.78,21.13 83.72,21.13 v82.5,22.35 | v81.89,30.12 79.76,30.12 78.84,31.04 v78.84,32.71
  Bottom 0.152: v163.73,40.03 163.73,42.62 162.97,43.38 162.97,51.31 163.58,51.92 | v164.34,52.68 163.58,51.92 | v167.23,65.48 v167.23,64.26 | v180.19,80.57 180.19,82.09 v177.29,84.99 | v162.36,90.63 161.9,90.63 160.07,92.46 160.07,95.96 160.83,96.72 162.36,96.72 IC6.3 | v56.59,47.95 56.59,48.41 56.74,48.57 56.74,51.92 55.68,52.98 36.17,52.98 33.27,50.09 28.55,50.09 v27.33,51.31 | v14.83,51.31 12.09,51.31 11.33,50.55 11.02,50.55 9.96,49.48 9.96,49.17 8.89,48.11 7.67,48.11 7.52,47.95 6.91,47.95 6.45,48.41 6.45,49.48 X1.A11 | v67.56,93.67 67.26,93.67 64.82,96.11 64.82,98.4 v62.84,100.38 | v57.66,118.36 v67.56,118.36 | v29.46,119.43 v32.97,119.43 | 163.58,51.92 162.97,52.53 159.46,52.53 155.8,48.87 155.8,41.55 153.37,39.12 153.37,35.92 152.76,35.31 151.99,35.31 151.54,35.76 151.54,38.35 152.76,39.57 152.76,40.18 152.45,40.49 141.17,40.49 139.04,38.35 126.69,38.35 125.32,36.98 125.32,35.76 124.1,34.54 122.58,34.54 114.05,26.01 114.05,24.18 v111.76,21.89 | v102.46,19 102.01,19 101.55,18.54 v94.69,18.54 | v94.69,19.91 94.69,20.22 v93.78,21.13 | v82.5,22.35 81.58,23.27 81.58,29.82 v81.89,30.12 | v78.84,32.71 78.84,33.63 76.4,36.07 v76.4,38.51
ADDR8  (via drill 0.33)
  Top 0.152: v97.74,24.49 96.52,25.7 92.41,25.7 90.88,24.18 90.27,24.18 IC15.9 | v107.8,30.12 v103.83,26.16 | v92.25,61.06 92.25,64.41 v90.88,65.79 | v91.03,74.17 91.03,81.79 90.27,82.55 IC37.9 | v180.03,15.65 180.03,9.55 174.7,4.22 v126.09,4.22 | v107.19,11.53 107.19,12.9 100.94,19.15 v100.94,19.76 | v153.37,77.83 153.37,72.19 151.54,70.36 149.25,70.36 148.18,69.29 148.18,67.61 v142.85,62.28 | v109.93,63.65 109.93,63.2 v107.8,61.06 | v9.65,30.28 8.89,30.28 7.82,31.34 7.82,31.8 6.76,32.87 6.3,32.87 5.23,33.93 5.23,49.94 6.3,51 6.3,52.07 X1.A12 | v22.3,17.48 v16.05,23.72
  Bottom 0.152: v103.83,26.16 102.01,24.33 98.65,24.33 98.5,24.49 v97.74,24.49 96.83,24.49 95.3,22.96 95.3,22.35 97.89,19.76 v100.94,19.76 | v107.8,30.12 107.8,52.07 102.01,57.86 | 102.01,57.86 98.81,61.06 v92.25,61.06 | v90.88,65.79 90.88,67.46 91.03,67.61 v91.03,74.17 | v180.03,15.65 180.03,19.91 179.12,20.83 179.12,24.03 IC25.9 | v126.09,4.22 114.5,4.22 v107.19,11.53 101.85,6.2 34.04,6.2 22.76,17.48 v22.3,17.48 | v153.37,77.83 158.39,82.85 169.22,82.85 169.82,82.24 169.82,81.03 171.04,79.81 176.99,79.81 178.36,81.18 178.97,81.18 IC7.9 | v142.85,62.28 115.42,62.28 114.35,63.35 110.24,63.35 v109.93,63.65 | v107.8,61.06 105.21,61.06 102.01,57.86 | v9.65,30.28 9.65,29.97 10.41,29.21 10.41,28.75 11.48,27.69 12.09,27.69 v16.05,23.72
ADDR9  (via drill 0.33)
  Top 0.152: v95.91,22.66 87.22,22.66 85.85,24.03 85.09,24.03 IC15.7 | v103.83,24.94 104.29,24.94 111.3,31.95 116.03,31.95 116.33,32.26 116.33,32.87 113.28,35.92 113.28,42.62 105.21,50.7 103.68,50.7 96.37,58.01 96.37,67.16 v95.91,67.61 | v95.91,81.18 93.02,84.07 v91.95,84.07 | v175.01,20.22 175.01,17.93 172.11,15.04 172.11,12.6 172.42,12.29 172.42,10.46 171.81,9.86 168.61,9.86 167.54,10.92 v167.54,12.14 | v109.32,11.23 101.7,18.85 v101.7,20.37 | v160.99,78.28 170.28,78.28 173.18,81.18 173.94,81.18 IC7.7 | v119.08,87.43 116.48,87.43 114.96,88.95 112.83,88.95 v108.56,84.68 | v26.72,75.69 26.72,76.91 27.48,77.67 42.42,77.67 v44.55,75.54 | v71.07,73.41 80.06,73.41 v81.58,74.93 | v84.78,78.89 84.78,82.24 IC37.7
  Bottom 0.152: v95.91,22.66 97.74,22.66 98.65,21.74 99.42,21.74 99.87,22.2 | 99.87,22.2 100.48,22.81 100.48,23.27 101.24,24.03 102.92,24.03 v103.83,24.94 | v95.91,81.18 95.91,79.96 | 95.91,79.96 v95.91,67.61 | v91.95,84.07 86.61,84.07 IC37.7 | v175.01,20.22 174.09,21.13 174.09,24.03 IC25.7 | v167.54,12.14 166.78,12.9 163.42,12.9 162.2,11.68 162.2,10.46 158.85,7.11 113.44,7.11 v109.32,11.23 | 99.87,22.2 v101.7,20.37 | v160.99,78.28 159,78.28 158.7,78.59 157.18,78.59 152.91,74.32 147.27,74.32 145.75,75.84 145.75,77.06 144.37,78.43 132.33,78.43 125.02,85.75 120.75,85.75 v119.08,87.43 | v108.56,84.68 103.83,79.96 95.91,79.96 | v26.72,75.69 12.24,61.21 11.48,61.21 10.41,60.15 10.41,59.69 9.35,58.62 8.89,58.62 7.82,57.56 7.82,57.1 6.45,55.73 6.45,54.66 X1.A13 | v44.55,75.54 47.3,72.8 49.43,72.8 52.17,70.05 52.17,67.46 54.61,65.02 68.63,65.02 71.07,67.46 v71.07,73.41 | v81.58,74.93 81.58,77.06 83.41,78.89 v84.78,78.89
ADDR10  (via drill 0.33)
  Top 0.152: v86,25.7 82.19,25.7 80.67,24.18 80.06,24.18 IC15.5 | v95.91,33.78 v95.91,29.06 | v95.91,38.35 98.04,40.49 98.04,42.62 97.13,43.54 97.13,45.21 99.57,47.65 103.38,47.65 103.83,48.11 103.83,48.72 100.63,51.92 v99.57,51.92 | v88.44,59.38 88.44,59.84 83.72,64.57 83.72,77.37 80.06,81.03 80.06,82.55 IC37.5 | 174.85,10.46 v174.85,14.58 | 174.85,10.46 171.5,7.11 122.88,7.11 v114.05,15.95 | v86.92,17.48 v88.44,15.95 | v178.21,79.5 177.9,79.5 175.31,76.91 v175.31,76.61 | v182.47,70.66 v178.82,74.32 | v178.36,8.79 177.9,8.33 176.99,8.33 174.85,10.46 | v5.23,60.91 5.23,59.38 6.3,58.32 6.3,57.25 X1.A14 | v106.43,2.39 115.57,11.53 115.57,12.6 v113.13,15.04
  Bottom 0.152: 86.77,25.7 92.56,25.7 v95.91,29.06 | 86.77,25.7 v86,25.7 | v95.91,38.35 v95.91,33.78 | v99.57,51.92 99.57,52.22 91.34,60.45 90.27,60.45 89.2,59.38 v88.44,59.38 | v174.85,14.58 174.85,15.49 174.55,15.8 172.87,15.8 170.59,18.09 170.59,20.07 170.74,20.22 170.74,22.2 168.91,24.03 IC25.5 | v88.44,15.95 113.13,15.95 | 113.13,15.95 v114.05,15.95 | v86.92,17.48 86.92,17.93 86.77,18.09 86.77,25.7 | v178.21,79.5 170.89,79.5 169.22,81.18 168.91,81.18 IC7.5 | v175.31,76.61 175.31,75.54 176.53,74.32 v178.82,74.32 | v182.47,70.66 182.47,67.77 191.16,59.08 191.16,22.81 180.03,11.68 180.03,10.46 v178.36,8.79 | v5.23,60.91 5.23,60.45 4.01,59.23 4.01,27.53 6.3,25.25 6.76,25.25 7.82,24.18 7.82,23.72 29.16,2.39 v106.43,2.39 | 113.13,15.95 v113.13,15.04
ADDR11  (via drill 0.33)
  Top 0.152: v79.6,87.12 92.71,87.12 v96.06,83.77 | v119.69,84.07 v107.04,84.07 | v153.98,70.51 153.98,71.42 156.26,73.71 v156.26,79.5 | v59.03,22.35 72.44,22.35 74.12,24.03 74.88,24.03 IC15.3 76.71,22.35 v79.15,22.35 | v53.85,22.35 53.85,21.44 51.71,19.3 51.71,18.09 50.95,17.32 v47.6,17.32 | v22.3,27.38 v23.82,25.86 | v160.99,16.87 155.8,16.87 155.19,17.48 153.21,17.48 152.3,16.56 v146.36,16.56 | v112.52,14.27 v114.96,11.84 | v86.16,16.71 v87.68,15.19
  Bottom 0.152: v79.6,87.12 75.03,82.55 IC37.3 | v96.06,83.77 96.06,82.24 98.04,80.26 103.23,80.26 v107.04,84.07 107.04,108.76 106.27,109.52 106.27,109.83 91.8,124.31 43.64,124.31 36.78,117.45 30.53,117.45 29.31,116.23 29.31,93.67 17.73,82.09 16.05,82.09 12.85,78.89 12.85,72.34 11.48,70.97 11.02,70.97 9.96,69.9 9.96,64.41 8.89,63.35 8.59,63.35 7.37,62.13 7.37,60.6 6.45,59.69 X1.A15 6.3,59.69 4.62,58.01 4.62,37.13 5.99,35.76 13,35.76 21.39,27.38 v22.3,27.38 | v119.69,84.07 123.49,84.07 138.74,68.83 138.74,67.46 141.63,64.57 153.67,64.57 155.19,66.09 155.19,69.29 v153.98,70.51 | v156.26,79.5 162.05,79.5 IC7.3 | v53.85,22.35 v59.03,22.35 | v47.6,17.32 44.09,13.82 44.09,13.66 43.49,13.06 39.68,13.06 37.08,15.65 34.04,15.65 v23.82,25.86 | v160.99,16.87 162.2,18.09 162.2,19.3 163.73,20.83 163.73,24.03 IC25.3 | v146.36,16.56 144.98,16.56 144.37,17.17 137.82,17.17 132.49,11.84 v114.96,11.84 | v112.52,14.27 88.59,14.27 v87.68,15.19 | v86.16,16.71 82.96,16.71 80.97,18.69 80.97,20.52 v79.15,22.35
ADDR12  (via drill 0.33)
  Top 0.152: v92.1,67 90.58,68.53 90.27,68.53 IC38.9 | v106.27,55.42 v97.59,64.11 | v109.02,18.54 109.02,12.45 v109.32,12.14
  Bottom 0.152: 90.27,9.7 90.27,11.38 IC16.9 | 90.27,9.7 93.47,6.5 101.24,6.5 106.88,12.14 107.49,12.14 108.41,11.23 | 108.41,11.23 114.81,4.83 153.82,4.83 156.26,2.39 169.98,2.39 178.97,11.38 IC26.9 179.12,11.53 179.43,11.53 190.86,22.96 190.86,58.93 184,65.79 182.47,65.79 179.73,68.53 179.12,68.53 IC8.9 | v92.1,67 92.1,66.7 94.69,64.11 v97.59,64.11 | v106.27,55.42 109.02,52.68 v109.02,18.54 | 108.41,11.23 v109.32,12.14 | 90.27,9.7 87.07,6.5 34.19,6.5 22.61,18.09 16.05,18.09 10.41,23.72 10.41,24.03 9.2,25.25 8.89,25.25 7.82,26.31 7.82,26.62 6.76,27.69 6.45,27.69 4.32,29.82 4.32,59.08 6.3,61.06 6.3,62.13 X1.A16
ADDR13  (via drill 0.33)
  Top 0.152: v114.96,16.26 127.3,16.26 135.53,8.03 145.75,8.03 | 145.75,8.03 171.35,8.03 173.94,10.62 173.94,11.38 IC26.7 | v89.36,65.63 89.36,65.18 v91.34,63.2 | v106.27,54.51 v97.59,63.2 | v108.41,13.66 v108.41,19.15 | v167.69,54.97 167.69,57.86 177.44,67.61 177.44,69.6 176.99,70.05 176.07,70.05 174.7,68.68 174.09,68.68 IC8.7 | v165.56,42.47 164.03,40.95 151.38,40.95 148.79,38.35 146.96,38.35 146.05,37.44 146.05,30.28 145.75,29.97 v145.75,10.16 | 145.75,8.03 v145.75,7.72 | v40.89,8.33 v20.62,8.33
  Bottom 0.152: 85.09,11.38 85.85,11.38 87.38,9.86 87.99,9.86 89.2,11.07 89.2,12.29 90.58,13.66 v108.41,13.66 112.83,13.66 114.96,15.8 v114.96,16.26 | v89.36,65.63 88.75,65.63 85.85,68.53 85.09,68.53 IC38.7 | v97.59,63.2 v91.34,63.2 | v106.27,54.51 106.27,54.05 108.41,51.92 v108.41,19.15 | v167.69,54.97 167.69,47.5 169.82,45.36 169.82,43.54 168.76,42.47 v165.56,42.47 | v145.75,7.72 v145.75,10.16 | v20.62,8.33 3.4,25.55 3.4,60.76 6.3,63.65 6.3,64.72 X1.A17 | v40.89,8.33 82.04,8.33 85.09,11.38 | 85.09,11.38 IC16.7
ADDR14  (via drill 0.33)
  Top 0.152: v189.64,47.65 184.15,47.65 182.78,49.02 182.78,69.29 181.71,70.36 170.59,70.36 168.91,68.68 IC8.5 | v12.24,22.81 6.15,22.81 4.01,24.94 v4.01,65.02 | v44.55,65.79 45.31,65.02 62.08,65.02 65.13,61.98 65.73,61.98 66.04,62.28 66.04,66.7 69.39,70.05 70.31,70.05 70.76,69.6 70.76,68.38 72.14,67 77.77,67 79.3,68.53 79.91,68.53 IC38.5 | v43.33,74.78 41.05,74.78 40.89,74.62 v21.54,74.62 | v10.57,68.83 7.98,68.83 6.45,67.31 X1.A18 | v126.09,3 v160.53,3 | v80.37,3 80.37,3.76 73.96,10.16 73.96,12.29 74.57,12.9 78.54,12.9 IC16.5
  Bottom 0.152: 168.91,11.38 169.67,11.38 171.2,9.86 176.84,9.86 178.21,11.23 178.21,12.45 188.11,22.35 188.11,23.27 189.18,24.33 189.64,24.33 190.55,25.25 190.55,46.74 v189.64,47.65 | v12.24,22.81 19.71,22.81 33.58,8.94 77.47,8.94 79.91,11.38 IC16.5 | v4.01,65.02 6.3,67.31 X1.A18 | v44.55,65.79 44.55,73.56 v43.33,74.78 | v21.54,74.62 17.73,74.62 11.94,68.83 v10.57,68.83 | v160.53,3 168.91,11.38 | v80.37,3 v126.09,3 | 168.91,11.38 IC26.5
ADDR15  (via drill 0.33)
  Top 0.152: v80.97,3.61 75.03,9.55 75.03,11.38 IC16.3 | v155.96,3.61 v125.48,3.61 113.28,15.8 v113.28,17.63 | v88.75,78.28 88.75,63.65 v91.34,61.06 | v185.22,33.63 183.69,33.63 182.78,32.71 182.78,23.42 181.41,22.05 170.28,22.05 v170.13,21.89 | v169.06,15.8 168.61,15.8 164.34,11.53 163.88,11.53 IC26.3 | v52.63,3.61 v24.43,3.61
  Bottom 0.152: v125.48,3.61 v80.97,3.61 v52.63,3.61 | v155.96,3.61 163.73,11.38 IC26.3 | v88.75,78.28 87.22,79.81 84.78,79.81 84.18,79.2 78.08,79.2 76.25,77.37 76.25,75.69 75.03,74.47 75.03,68.68 IC38.3 | v91.34,61.06 100.48,51.92 104.29,51.92 104.6,51.61 104.6,50.7 102.62,48.72 102.62,47.04 105.36,44.3 105.36,21.29 109.02,17.63 v113.28,17.63 | v185.22,33.63 185.22,35.61 186.28,36.68 189.33,36.68 190.25,37.59 190.25,46.13 189.03,47.35 189.03,52.38 182.17,59.23 176.07,59.23 168.91,66.4 161.59,66.4 160.38,67.61 160.38,69.6 160.83,70.05 161.75,70.05 163.12,68.68 163.73,68.68 IC8.3 | v170.13,21.89 169.82,21.89 168,20.07 168,16.87 v169.06,15.8 | v24.43,3.61 3.1,24.94 3.1,65.48 6.3,68.68 6.3,69.75 X1.A19
DATA0  (via drill 0.33)
  Top 0.152: v49.43,18.24 49.43,30.58 IC11.15 46.69,33.33 46.69,38.05 46.99,38.35 46.99,50.09 48.21,51.31 48.21,57.1 IC9.15 | v75.34,84.38 75.34,84.07 76.56,82.85 76.56,79.2 v77.77,77.98 | v79.3,61.98 v79.3,66.09 | v82.19,58.93 76.71,58.93 IC13.18 | v66.65,30.89 67.11,30.89 68.33,29.67 73.05,29.67 75.03,31.65 IC15.18 | v155.65,31.19 156.26,31.19 158.39,33.33 162.2,33.33 163.73,31.8 IC25.18 | 135.84,84.68 135.84,87.58 IC3.15 140.72,92.46 v140.72,112.72 | 135.84,84.68 135.84,68.07 137.06,66.85 137.06,57.25 IC19.15 | v157.63,57.86 157.63,58.01 160.07,60.45 162.97,60.45 163.73,59.69 163.73,57.25 IC23.18 | v157.48,91.54 148.18,82.24 148.18,79.81 146.96,78.59 145.59,78.59 v144.68,79.5 | v141.48,84.07 139.04,84.07 138.43,84.68 135.84,84.68 | v141.17,47.5 140.87,47.5 138.74,45.36 138.74,44.15 136.3,41.71 136.3,34.09 137.06,33.33 137.06,31.8 IC21.15 | v46.69,99.16 46.69,105.1 44.86,106.93 44.86,110.44 48.21,113.79 48.21,115.47 IC29.15 | v54,117.75 v57.05,117.75 | v27.63,92.91 37.54,92.91 38.76,91.69 46.69,91.69 48.21,90.17 IC31.15 | v128.37,124 v131.72,120.65 | v70,122.78 v99.11,122.78 | v2.79,68.83 2.79,25.25 16.51,11.53 36.78,11.53 RN1.9
  Bottom 0.152: v49.43,18.24 42.72,11.53 36.93,11.53 RN1.9 | IC15.18 74.88,31.8 74.88,35 73.96,35.92 73.96,41.55 76.1,43.69 76.1,56.03 75.03,57.1 IC13.18 | v75.34,84.38 75.34,85.9 75.03,86.21 75.03,90.17 IC37.18 | v77.77,77.98 77.32,77.98 76.56,77.22 76.56,67.61 77.93,66.24 79.15,66.24 v79.3,66.09 | v79.3,61.98 82.19,59.08 v82.19,58.93 | v66.65,30.89 63.91,33.63 50.8,33.63 48.97,31.8 48.36,31.8 IC11.15 | 137.82,115.62 137.21,115.62 IC1.15 137.06,115.62 136.45,115.62 134.01,118.06 134.01,118.36 v131.72,120.65 | 137.82,115.62 139.34,117.14 150.17,117.14 151.54,115.77 151.54,114.55 152.15,113.94 155.8,113.94 156.72,113.03 161.29,113.03 IC5.18 | v155.65,31.19 154.13,29.67 139.5,29.67 137.52,31.65 137.21,31.65 IC21.15 | v157.63,57.86 157.63,58.17 156.72,59.08 139.04,59.08 137.21,57.25 IC19.15 137.06,57.1 136.3,56.34 136.3,48.57 137.36,47.5 v141.17,47.5 | v157.48,91.54 160.53,91.54 163.12,88.95 163.73,88.95 IC7.18 | v144.68,79.5 143.15,81.03 143.15,82.4 v141.48,84.07 | v140.72,112.72 137.82,115.62 | v46.69,99.16 46.69,94.89 48.21,93.37 48.21,90.17 IC31.15 | IC35.18 72.75,117.75 v57.05,117.75 | IC29.15 48.36,115.62 50.5,117.75 v54,117.75 59.03,122.78 v70,122.78 | v27.63,92.91 26.42,92.91 12.55,79.04 12.55,77.06 11.94,76.45 11.48,76.45 10.41,75.39 10.41,74.93 9.35,73.86 8.89,73.86 7.52,72.49 6.45,72.49 X1.A20 v2.79,68.83 | v128.37,124 100.33,124 v99.11,122.78
DATA1  (via drill 0.33)
  Top 0.152: RN1.8 36.93,13.97 36.93,14.73 45.62,23.42 45.62,24.03 IC11.1 | v46.69,26.47 46.69,32.71 44.86,34.54 v44.86,35.15 44.86,37.9 46.69,39.73 46.69,45.36 45.77,46.28 45.77,49.48 IC9.1 45.77,49.63 45.77,52.53 46.69,53.44 46.69,59.84 44.25,62.28 v44.25,63.2 | v74.88,29.97 73.81,29.97 73.05,29.21 v67.26,29.21 | 45.77,82.55 45.77,85.75 49.73,89.71 49.73,92.3 | 49.73,92.3 49.73,103.89 45.77,107.85 IC29.1 | v75.95,84.99 72.9,84.99 70.76,82.85 70.76,81.64 70.16,81.03 60.55,81.03 59.33,82.24 59.33,83.46 58.73,84.07 58.12,84.07 57.2,83.16 57.2,68.07 56.13,67 55.52,67 54.46,68.07 54.46,70.05 | 54.46,70.05 54.46,71.88 51.71,74.62 50.5,74.62 49.12,76 49.12,79.2 45.77,82.55 | 45.77,82.55 IC31.1 | v28.25,93.52 37.39,93.52 38.61,92.3 49.73,92.3 | v47.14,69.29 47.9,70.05 54.46,70.05 | v108.56,112.12 89.97,112.12 88.9,111.05 88.9,107.39 87.99,106.48 87.22,106.48 86.77,106.93 86.77,108.15 80.06,114.86 80.06,115.47 IC35.16 | v151.69,120.5 144.22,120.5 140.87,117.14 139.34,117.14 138.74,116.53 138.74,115.32 134.62,111.2 IC1.1 134.62,107.24 138.74,103.12 138.74,100.69 v140.11,99.31 | v153.82,27.08 154.13,27.08 155.04,27.99 v165.25,27.99 | 134.62,51 134.62,55.27 132.33,57.56 132.33,69.6 131.12,70.81 131.12,71.42 133.71,74.02 133.71,80.26 134.62,81.18 IC3.1 | 134.62,51 IC19.1 | v143,60.6 v145.29,60.6 | v160.68,92.76 154.43,92.76 150.77,89.1 150.77,87.88 150.32,87.43 149.4,87.43 148.18,88.65 148.18,89.86 146.96,91.08 v145.44,91.08 | IC21.1 134.62,23.42 v135.69,22.35 | v140.41,20.68 140.41,22.5 141.02,23.11 141.02,46.43 142.09,47.5 v142.09,47.8 | 134.62,51 v137.97,51
  Bottom 0.152: IC11.1 46.69,25.09 v46.69,26.47 64.52,26.47 v67.26,29.21 | v74.88,29.97 77.62,29.97 79.3,31.65 79.91,31.65 IC15.16 | v44.86,35.15 45.01,35 61.01,35 61.93,35.92 61.93,37.13 64.82,40.03 64.82,48.11 72.29,55.58 72.75,55.58 73.35,56.19 73.35,57.4 74.57,58.62 77.93,58.62 79.3,57.25 79.91,57.25 IC13.16 | v75.95,84.99 79.91,88.95 79.91,90.17 IC37.16 | X1.A21 7.37,74.93 8.89,76.45 9.35,76.45 10.41,77.52 10.41,77.98 11.33,78.89 11.94,78.89 26.57,93.52 v28.25,93.52 28.25,100.84 29.01,101.6 29.01,104.95 26.26,107.7 26.26,108.91 23.06,112.12 22.45,112.12 22,112.57 22,114.1 33.12,125.22 95.76,125.22 108.71,112.27 | v44.25,63.2 47.14,66.09 v47.14,69.29 | 108.71,112.27 119.53,123.09 148.64,123.09 151.23,120.5 | 151.23,120.5 154.28,117.45 167.08,117.45 168.91,115.62 IC5.16 | 151.23,120.5 v151.69,120.5 | v153.82,27.08 152.15,27.08 151.84,26.77 137.21,26.77 134.62,24.18 IC21.1 | v165.25,27.99 168.91,31.65 IC25.16 | v145.29,60.6 156.26,60.6 157.63,59.23 173.79,59.23 174.85,58.17 174.85,56.19 174.24,55.58 171.2,55.58 169.67,57.1 168.91,57.1 IC23.16 | v143,60.6 138.74,60.6 135.53,57.4 135.53,50.55 134.62,49.63 IC19.1 | v160.68,92.76 161.59,91.85 165.25,91.85 168.15,88.95 168.91,88.95 IC7.16 | 145.14,91.08 143.15,89.1 143.15,86.66 140.56,84.07 140.56,80.26 140.11,79.81 139.34,79.81 138.12,81.03 138.12,82.24 137.52,82.85 136.14,82.85 134.62,81.33 IC3.1 | v135.69,22.35 138.74,22.35 v140.41,20.68 | v142.09,47.8 140.56,49.33 140.56,50.55 140.11,51 v137.97,51 | v140.11,99.31 143.92,95.5 143.92,92.3 145.14,91.08 | 145.14,91.08 v145.44,91.08 | 108.71,112.27 v108.56,112.12
DATA2  (via drill 0.33)
  Top 0.152: 172.42,33.33 166.01,33.33 165.41,32.71 165.41,31.5 164.19,30.28 151.99,30.28 150.62,31.65 149.86,31.65 IC21.10 | IC25.14 172.42,33.33 | v158.85,54.97 158.55,54.97 157.94,55.58 152.15,55.58 150.62,57.1 149.86,57.1 IC19.10 | 172.42,33.33 172.42,35.46 172.72,35.76 172.72,37.9 171.2,39.42 v170.89,39.42 | v172.42,52.22 172.42,55.58 IC23.14 174.09,57.25 174.09,61.21 v174.55,61.67 | IC3.10 149.86,90.63 146.36,94.13 146.36,111.96 149.86,115.47 IC1.10 | v169.98,87.12 171.5,87.12 173.18,88.8 173.94,88.8 IC7.14 177.29,85.6 v179.12,85.6 | v178.21,71.88 178.21,77.22 v180.8,79.81 | v41.35,47.5 41.35,44.6 35.56,38.81 35.56,35.76 38.91,32.41 38.91,25.7 38.76,25.55 38.76,19.15 36.93,17.32 36.93,16.56 RN1.7 | IC9.10 60.86,57.1 60.4,57.1 v55.52,52.22 57.2,50.55 57.2,43.84 58.73,42.32 v58.73,40.03 | 62.23,35.76 61.01,34.54 61.01,31.8 IC11.10 | v62.23,38.35 62.23,35.76 | v75.95,28.45 81.13,28.45 84.33,31.65 85.09,31.65 IC15.14 | v72.44,33.63 70.76,35.31 62.69,35.31 62.23,35.76 | v67.41,91.08 68.94,91.08 69.55,91.69 83.57,91.69 IC37.14 | v28.4,104.19 30.68,106.48 30.84,106.48 32.05,107.7 32.05,108.91 v34.65,111.51 | v54,88.65 54,88.95 54.3,89.26 54.3,100.08 52.48,101.91 52.48,111.96 v52.78,112.27 | v65.43,62.59 65.43,66.7 v65.13,67 | v61.93,78.13 v61.93,73.1 | v90.42,51.92 v96.98,51.92
  Bottom 0.152: v158.85,54.97 160.99,54.97 162.97,56.95 162.97,58.17 163.73,58.93 172.26,58.93 173.94,57.25 IC23.14 | v170.89,39.42 170.89,43.08 170.59,43.38 170.59,46.74 172.42,48.57 v172.42,52.22 | v169.98,87.12 155.5,87.12 155.19,87.43 151.23,87.43 149.86,88.8 IC3.10 | IC5.14 173.94,115.47 173.18,115.47 167.84,110.13 156.41,110.13 152.76,106.48 149.4,106.48 148.95,106.93 148.95,114.55 149.86,115.47 IC1.10 | v174.55,61.67 174.55,67.31 175.62,68.38 175.62,69.6 177.9,71.88 v178.21,71.88 | v180.8,79.81 182.02,79.81 182.47,80.26 182.47,82.24 v179.12,85.6 | v41.35,47.5 41.81,47.5 46.53,52.22 v55.52,52.22 | v62.23,38.35 61.32,38.35 59.64,40.03 v58.73,40.03 | v75.95,28.45 75.03,28.45 73.35,30.12 73.35,32.71 v72.44,33.63 | 85.09,57.25 79.45,62.89 65.43,62.89 | 65.43,62.89 63.14,62.89 61.01,60.76 61.01,57.25 IC9.10 | 61.62,90.17 IC31.10 60.25,90.17 58.73,91.69 55.52,91.69 54.3,90.47 54.3,88.95 v54,88.65 | 61.62,90.17 63.14,91.69 66.8,91.69 v67.41,91.08 | IC35.14 85.09,115.47 83.72,114.1 74.57,114.1 73.96,114.71 73.96,115.93 72.44,117.45 62.84,117.45 IC29.10 60.86,115.62 59.03,117.45 57.96,117.45 57.2,116.69 57.2,115.01 56.29,114.1 54.61,114.1 v52.78,112.27 52.02,111.51 v34.65,111.51 | v28.4,104.19 28.7,103.89 28.7,101.75 13.46,86.51 6.3,86.51 5.23,85.45 5.23,79.65 6.3,78.59 6.3,77.52 X1.A22 | v65.43,62.59 65.43,62.89 | v65.13,67 63.14,67 61.93,68.22 v61.93,73.1 | v61.93,78.13 61.93,89.86 61.62,90.17 | v96.98,51.92 96.98,51.46 97.74,50.7 98.5,50.7 105.05,44.15 105.05,21.13 109.17,17.02 113.59,17.02 121.21,24.64 125.17,24.64 134.16,33.63 139.65,33.63 140.56,32.71 140.56,31.5 141.78,30.28 147.73,30.28 149.1,31.65 149.86,31.65 IC21.10
  Bottom 0.152: 85.09,57.25 v90.42,51.92 | 85.09,57.25 IC13.14
DATA3  (via drill 0.33)
  Top 0.152: v156.41,58.47 156.87,58.47 157.48,59.08 | 157.48,59.08 159.46,61.06 v164.03,61.06 | v172.11,61.06 172.57,61.06 174.09,62.59 175.01,62.59 178.97,58.62 178.97,57.25 IC23.12 | 172.87,38.35 173.03,38.2 173.03,35.92 175.62,33.33 177.44,33.33 178.97,31.8 IC25.12 | 172.87,38.35 171.2,40.03 170.59,40.03 170.28,39.73 170.28,39.12 170.59,38.81 171.35,38.81 172.42,37.74 172.42,35.92 170.74,34.24 166.47,34.24 165.56,33.33 163.12,33.33 162.81,33.63 158.24,33.63 156.41,31.8 152.45,31.8 IC21.9 | v176.53,40.95 177.44,40.03 177.44,39.42 v176.68,38.66 | 172.87,38.35 v173.18,38.66 | v154.58,118.06 152.45,115.93 152.45,115.62 IC1.9 152.45,115.47 152.45,111.66 153.37,110.74 153.37,105.71 150.77,103.12 150.77,99.77 148.34,97.33 148.34,93.52 v149.25,92.61 | IC3.9 152.45,88.95 153.98,88.95 157.18,92.15 165.1,92.15 168,95.05 168,96.27 168.45,96.72 171.81,96.72 173.03,95.5 173.03,94.28 174.55,92.76 175.16,92.76 178.97,88.95 IC7.12 | v151.08,65.48 157.48,59.08 | v151.54,71.27 151.54,78.59 153.98,81.03 153.98,86.66 v155.5,88.19 | IC29.9 63.6,115.62 63.6,116.69 68.33,121.41 84.94,121.41 90.12,116.23 90.12,115.62 IC35.12 90.27,115.47 90.73,115.47 92.1,114.1 95.61,114.1 101.7,120.19 v102.16,120.19 | v62.84,59.23 63.91,59.23 69.09,54.05 86.61,54.05 87.53,54.97 87.99,54.97 IC13.12 90.12,57.25 90.12,58.62 86,62.74 86,70.36 84.78,71.58 84.78,74.02 86.61,75.84 v86.61,81.33 | v63.45,112.57 62.84,112.57 v60.25,109.98 | v58.57,97.33 57.51,96.27 57.51,94.28 60.1,91.69 61.93,91.69 63.45,90.17 IC31.9 | v39.07,18.54 39.07,19.76 v45.01,25.7 | 86.77,33.93 75.18,33.93 73.66,32.41 73.66,30.73 72.9,29.97 68.48,29.97 66.8,31.65 63.6,31.65 IC11.9
  Top 0.152: 86.77,33.93 87.38,33.93 89.51,31.8 90.12,31.8 IC15.12 | v26.42,25.25 5.84,25.25 4.62,26.47 4.62,77.22 6.3,78.89 6.3,79.96 X1.A23 | v91.19,46.28 91.19,42.62 v90.12,41.55 | 86.77,33.93 v86.77,38.2
  Bottom 0.152: v156.41,58.47 155.19,57.25 152.45,57.25 IC19.9 | v172.11,61.06 v164.03,61.06 | v176.53,40.95 175.62,41.86 175.62,45.36 176.23,45.97 177.75,45.97 178.51,46.74 178.51,47.35 178.21,47.65 178.21,50.55 178.97,51.31 178.97,57.1 IC23.12 | v173.18,38.66 v176.68,38.66 | v154.58,118.06 168,118.06 168.61,117.45 169.52,117.45 | 169.52,117.45 177.14,117.45 178.97,115.62 IC5.12 | v149.25,92.61 150.62,92.61 152.3,90.93 152.3,88.95 IC3.9 152.45,88.8 153.06,88.19 v155.5,88.19 | v151.08,65.48 151.08,70.81 v151.54,71.27 | v62.84,59.23 63.45,58.62 63.45,57.25 IC9.9 | IC31.9 65.89,90.17 68.63,87.43 68.63,85.6 71.53,82.7 71.53,81.48 72.9,80.11 76.1,80.11 77.01,81.03 82.96,81.03 83.87,81.94 | 83.87,81.94 84.18,82.24 84.18,84.23 90.12,90.17 IC37.12 | v86.61,81.33 85.7,81.33 85.39,81.03 84.78,81.03 83.87,81.94 | v63.45,112.57 63.45,115.47 IC29.9 | v60.25,109.98 60.25,109.07 59.94,108.76 59.94,100.84 59.33,100.23 59.33,98.09 v58.57,97.33 | v39.07,18.54 38.61,19 36.93,19 RN1.6 36.78,19.15 30.68,25.25 v26.42,25.25 | v45.01,25.7 49.58,30.28 56.29,30.28 57.51,31.5 57.51,32.71 58.12,33.33 61.93,33.33 IC11.9 | v91.19,46.28 91.19,49.94 92.86,51.61 92.86,53.9 90.27,56.49 90.27,57.1 IC13.12 | v86.77,38.2 v90.12,41.55 | 169.52,117.45 169.52,118.36 168.61,119.28 153.82,119.28 149.71,123.39 105.36,123.39 v102.16,120.19
DATA4  (via drill 0.33)
  Top 0.152: IC22.15 137.21,19.15 137.21,22.35 138.43,23.57 138.43,28.6 135.99,31.04 135.99,43.38 137.06,44.45 IC20.15 | v146.96,17.17 152.45,17.17 153.06,17.78 155.35,17.78 155.65,17.48 161.59,17.48 163.12,19 163.73,19 IC26.18 | v138.12,84.07 136.14,82.09 136.14,77.22 IC4.15 | v164.95,54.81 164.95,61.06 160.53,65.48 152.15,65.48 151.38,66.24 v148.64,66.24 | v145.44,110.9 145.44,110.44 143.76,108.76 v143.76,105.56 | v146.36,48.26 146.36,50.39 146.96,51 150.32,51 151.54,49.78 151.54,48.57 152.15,47.95 154.43,47.95 v155.19,48.72 | v72.9,21.13 60.4,21.13 v59.49,20.22 | v62.23,96.72 65.43,96.72 65.58,96.57 68.48,96.57 70,98.09 v71.68,98.09 | v46.38,61.06 49.12,58.32 49.12,48.11 48.36,47.35 48.36,44.45 IC10.15 | v49.12,72.19 49.12,75.39 48.36,76.15 IC32.15 | IC14.18 74.27,44.45 72.75,42.93 v64.21,42.93 | v59.64,43.84 59.64,45.06 58.57,46.13 v57.81,46.13 | v67.41,67 67.41,63.2 65.43,61.21 63.3,61.21 v61.62,62.89 | X1.A24 7.37,82.55 8.43,81.48 v16.36,81.48 | v29.01,81.48 41.81,81.48 v45.31,77.98 | v55.22,93.52 55.22,91.39 54.92,91.08 54.92,87.12 54.3,86.51 54.3,81.18 v51.41,78.28 | v37.24,25.4 37.54,25.7 37.69,25.7 38.3,26.31 38.3,29.67 37.08,30.89 35.87,30.89 33.12,33.63 33.12,38.35 v35.71,40.95 | v115.72,32.56 115.72,33.02 112.98,35.76 112.98,42.47 105.05,50.39 103.53,50.39 96.06,57.86 96.06,58.32 95.76,58.62 92.25,58.62 91.34,57.71 91.34,56.03 88.29,52.98 75.34,52.98 73.96,51.61 v73.66,51.61
  Bottom 0.152: v146.96,17.17 144.83,17.17 144.53,17.48 138.74,17.48 IC22.15 | 146.36,72.8 160.38,72.8 163.73,76.15 IC8.18 | 146.36,72.8 143.76,72.8 141.33,75.23 141.33,76.45 140.11,77.67 139.34,77.67 137.97,76.3 137.21,76.3 IC4.15 | v138.12,84.07 138.12,96.11 137.21,97.03 137.21,102.82 IC2.15 137.21,102.97 139.8,105.56 v143.76,105.56 | v164.95,54.81 164.95,53.29 | 164.95,53.29 164.95,48.72 163.88,47.65 163.88,44.45 IC24.18 | v148.64,66.24 147.73,66.24 146.36,67.61 146.36,72.8 | v145.44,110.9 146.2,110.9 148.18,108.91 148.18,106.78 150.77,104.19 150.77,102.67 152.15,101.29 152.76,101.29 153.06,101.6 156.41,101.6 156.72,101.29 161.59,101.29 163.12,102.82 163.73,102.82 IC6.18 | v146.36,48.26 143.92,45.82 143.92,44.3 142.55,42.93 139.34,42.93 137.82,44.45 IC20.15 136.45,44.45 132.94,40.95 121.67,40.95 118.16,37.44 118.16,35 v115.72,32.56 | v155.19,48.72 159.77,53.29 164.95,53.29 | 36.93,21.59 39.68,18.85 39.68,18.69 42.72,15.65 43.64,15.65 44.55,16.56 44.55,19.76 45.31,20.52 46.08,20.52 47.45,19.15 48.21,19.15 IC12.15 49.73,20.52 58.88,20.52 59.18,20.22 v59.49,20.22 | v72.9,21.13 74.88,19.15 IC16.18 | v62.23,96.72 54.92,96.72 | 54.92,96.72 52.02,96.72 48.36,100.38 48.36,102.82 IC30.15 | v71.68,98.09 71.68,99.31 74.88,102.51 74.88,102.82 IC36.18 | v46.38,61.06 46.38,63.5 49.12,66.24 | v49.12,72.19 49.12,66.24 | v64.21,42.93 60.55,42.93 v59.64,43.84 | v57.81,46.13 50.65,46.13 48.97,44.45 IC10.15 48.21,44.45 44.7,40.95 v35.71,40.95 | v67.41,67 67.41,71.12 70.61,74.32 72.44,74.32 74.27,76.15 74.88,76.15 IC38.18 | v61.62,62.89 52.48,62.89 49.12,66.24 | v29.01,81.48 v16.36,81.48
  Bottom 0.152: v45.31,77.98 46.53,77.98 48.21,76.3 IC32.15 50.34,78.28 v51.41,78.28 | 54.92,96.72 54.92,93.83 v55.22,93.52 | 36.93,21.59 36.93,22.35 38.3,23.72 38.3,24.49 37.39,25.4 v37.24,25.4 | 36.93,21.59 RN1.5 | v73.66,51.61 73.66,45.67 74.88,44.45 IC14.18
DATA5  (via drill 0.33)
  Top 0.152: v128.98,33.93 128.98,18.24 | 128.98,18.24 128.98,17.02 131.72,14.27 131.88,14.27 134.62,11.53 IC22.1 134.62,11.38 137.67,8.33 171.2,8.33 173.03,10.16 173.03,12.29 174.24,13.51 v174.24,15.19 | v164.49,45.97 162.05,45.97 161.75,46.28 149.86,46.28 148.18,44.6 148.18,41.25 v146.36,39.42 | v127.91,77.52 127.91,81.03 125.78,83.16 125.78,86.36 134.62,95.2 IC2.1 | v156.57,67 159,67 159.61,67.61 159.61,69.14 164.8,74.32 164.8,76.45 166.01,77.67 166.78,77.67 168.15,76.3 168.91,76.3 IC8.16 | v153.37,100.23 153.37,100.69 157.63,104.95 166.62,104.95 168.61,102.97 168.91,102.97 IC6.16 | v148.03,100.23 v149.25,100.23 | v164.49,47.19 163.73,47.95 163.58,47.95 162.51,49.02 162.51,51 161.9,51.61 161.9,54.2 160.38,55.73 v160.38,59.84 | v35.26,15.04 35.26,22.5 36.78,24.03 RN1.4 36.93,24.18 38.61,25.86 38.61,31.8 v37.54,32.87 36.32,32.87 33.43,35.76 33.43,37.9 35.87,40.34 36.02,40.34 38.15,42.47 38.15,52.83 39.07,53.75 39.07,59.38 36.47,61.98 36.47,65.79 34.65,67.61 34.65,69.6 35.1,70.05 36.02,70.05 37.24,68.83 37.24,67.61 37.85,67 44.09,67 45.62,68.53 IC32.1 45.77,68.68 45.77,72.03 46.99,73.25 | v60.86,14.88 76.56,14.88 79.91,18.24 79.91,19 IC16.16 | v77.47,42.32 v79.3,42.32 | v76.25,42.32 75.18,42.32 73.81,40.95 62.84,40.95 v59.94,38.05 | 46.99,73.25 46.99,79.35 44.86,81.48 44.86,87.43 v46.84,89.41 | v66.8,77.67 72.75,77.67 73.35,77.06 73.35,75.84 74.57,74.62 77.77,74.62 79.3,76.15 79.91,76.15 IC38.16 | v53.85,71.58 48.67,71.58 46.99,73.25 | v65.28,101.91 67.72,104.34 77.93,104.34 79.3,102.97 79.91,102.97 IC36.16 | v63.75,100.38 62.99,99.62 60.55,99.62 59.94,99.01 v58.73,99.01
  Top 0.152: v49.12,100.53 49.12,98.7 45.77,95.35 IC30.1 45.62,95.2 43.03,92.61 38.76,92.61 37.24,94.13 v27.63,94.13 | 128.98,18.24 112.98,18.24 111.91,17.17 111.91,10.16 108.1,6.35 85.09,6.35 80.52,1.78 55.37,1.78 IC12.1